# EAGLE design rs422_protect (EAGLE 7.7.0)
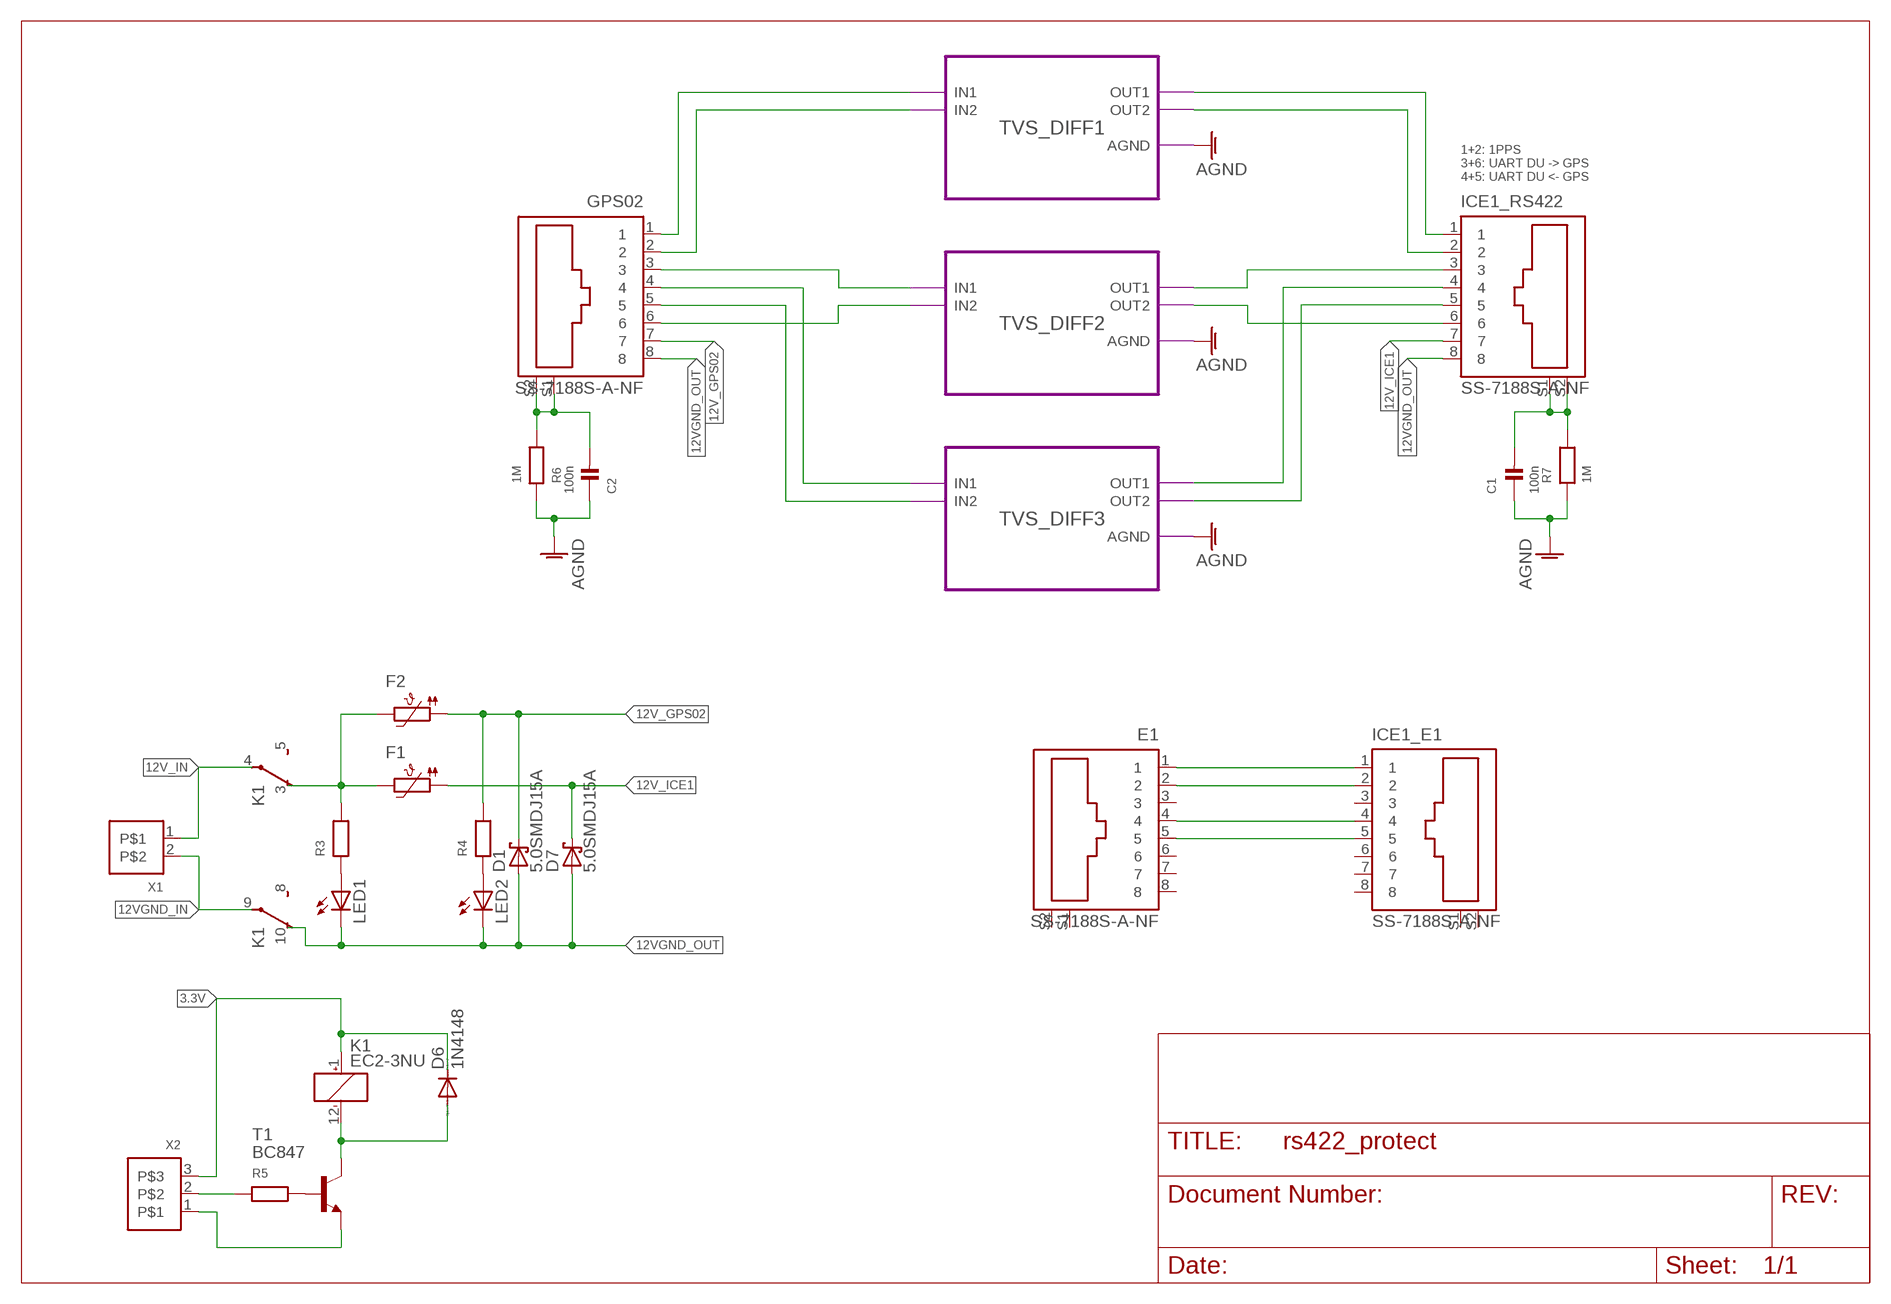
[diagram p0: schematic, sheet 1]

## Parts
C1  100n  CAP_CERAMIC_0603  [_0603]
C2  100n  CAP_CERAMIC_0603  [_0603]
D1  5.0SMDJ15A  SCHOTTKY-DIODESMC  [SMC]
D6  1N4148  DIODE-SOD323-W  [SOD323-W]
D7  5.0SMDJ15A  SCHOTTKY-DIODESMC  [SMC]
E1  SS-7188S-A-NF  [SS-7188S-A-NF]
F1  POLYFUSE-1812  [1812]
F2  POLYFUSE-1812  [1812]
GPS02  SS-7188S-A-NF  [SS-7188S-A-NF]
ICE1_E1  SS-7188S-A-NF  [SS-7188S-A-NF]
ICE1_RS422  SS-7188S-A-NF  [SS-7188S-A-NF]
K1  EC2-3NU  EC2-_S  [EC2-SINGLECOIL]
LED1  LEDCHIPLED_0805  [CHIPLED_0805]
LED2  LEDCHIPLED_0805  [CHIPLED_0805]
R3  RESISTOR_0603  [_0603]
R4  RESISTOR_0603  [_0603]
R5  RESISTOR_0603  [_0603]
R6  1M  RESISTOR_0603  [_0603]
R7  1M  RESISTOR_0603  [_0603]
T1  BC847  [SOT23]
X1  RIA_1X2-230  [RIA230]
X2  RIA_1X3-182  [RIA182-03]

## Module instances
TVS_DIFF1 = TVS_DIFF
TVS_DIFF2 = TVS_DIFF
TVS_DIFF3 = TVS_DIFF

## Nets
3.3V: D6.C K1.1(+) X2.3
12V_GPS02: D1.C F2.1 GPS02.7 R4.2
12V_ICE1: D7.C F1.1 ICE1_RS422.7
12V_IN: K1.4(P) X1.1
12V_SWITCHED: F1.2 F2.2 K1.3(O) R3.2
12VGND_IN: K1.9(P) X1.2
12VGND_OUT: D1.A D7.A GPS02.8 ICE1_RS422.8 K1.10(O) LED1.C LED2.C
AGND: C1.1 C2.1 R6.1 R7.1 ; port TVS_DIFF3.AGND TVS_DIFF2.AGND TVS_DIFF1.AGND
N$1: GPS02.1 ; port TVS_DIFF1.IN1
N$2: GPS02.2 ; port TVS_DIFF1.IN2
N$3: D6.A K1.12(-) T1.3(C)
N$4: C2.2 GPS02.S1 GPS02.S2 R6.2
N$5: R5.2 T1.1(B)
N$6: C1.2 ICE1_RS422.S1 ICE1_RS422.S2 R7.2
N$7: LED1.A R3.1
N$8: LED2.A R4.1
N$9: R5.1 X2.2
N$10: GPS02.3 ; port TVS_DIFF2.IN1
N$11: GPS02.6 ; port TVS_DIFF2.IN2
N$12: T1.2(E) X2.1
N$13: GPS02.4 ; port TVS_DIFF3.IN1
N$14: GPS02.5 ; port TVS_DIFF3.IN2
N$15: ICE1_RS422.1 ; port TVS_DIFF1.OUT1
N$16: ICE1_RS422.2 ; port TVS_DIFF1.OUT2
N$17: ICE1_RS422.3 ; port TVS_DIFF2.OUT1
N$18: ICE1_RS422.6 ; port TVS_DIFF2.OUT2
N$19: ICE1_RS422.4 ; port TVS_DIFF3.OUT1
N$20: ICE1_RS422.5 ; port TVS_DIFF3.OUT2
N$21: E1.1 ICE1_E1.1
N$22: E1.2 ICE1_E1.2
N$23: E1.4 ICE1_E1.4
N$24: E1.5 ICE1_E1.5
Unconnected: E1.3 E1.6 E1.7 E1.8 E1.S1 E1.S2 ICE1_E1.3 ICE1_E1.6 ICE1_E1.7 ICE1_E1.8 ICE1_E1.S1 ICE1_E1.S2 K1.5(S) K1.8(S)

## Notes on the sheet
- 1+2: 1PPS
  3+6: UART DU -> GPS
  4+5: UART DU <- GPS

## Library data of the parts
C1 C2 = rc-sysmocom:CAP_CERAMIC: Ceramic Capacitors 0402 - 0402 Surface Mount Capacitors 16pF 50V 5% [Digikey: 445-4899-2-ND] 18pF 50V 5% [Digikey: 490-1281-2-ND] 22pF 50V 5% [Digikey: 490-1283-2-ND] 68pF 50V 5% [Digikey: 490-1289-2-ND] 0.1uF 10V 10% [Digikey: 490-1318-2-ND] 1.0uF 6.3V 10% [Digikey: 490-1320-2-ND] 0603 - 0603 Surface Mount Capacitors 16 pF 50V 5% [Digikey: 445-5051-2-ND] 22 pF 50V [Digikey: PCC220ACVTR-ND] 33 pF 50V 5% [Digikey: 490-1415-1-ND] 56pF 50V 5% [Digikey: 490-1421-1-ND] 220pF 50V 5% [Digikey: 445-1285-1-ND] 680 pF 50V 2200 pF 50V 5% C0G [Digikey: 445-1297-1-ND] 5600 pF 100V 5% X7R [Digikey: 478-3711-1-ND] 0.1 µF 25V 10% [Digikey: PCC2277TR-ND] 0.22 µF 16V 10% X7R [Digikey: 445-1318-1-ND] 1.0 µF 25V 10% [Digikey: 445-5146-2-ND] 0603 - RF Specific 3pF 250V +/-0.1pF RF [Digikey: 712-1347-1-ND] 18 pF 250V 5% [Digikey: 478-3505-1-ND or 712-1322-1-ND] 56 pF 250V 5% C0G RF [Digikey: 490-4867-1-ND] 68 pF 250V RF [Digikey: 490-4868-1-ND] 0805 - 0805 Surface Mount Capacitors 220 pF 250V 2% RF Ceramic Capacitor [Digikey: 712-1398-1-ND] 1000 pF 50V 2% NP0 Ceramic Capacitor [Digikey: 478-3760-1-ND] 0.1 µF 25V 10% Ceramic Capacitor [Digikey: PCC1828TR-ND] 1.0 µF 16V 10% Ceramic Capacitor[Digikey: 490-1691-2-ND] 10.0 µF 10V 10% Ceramic Capacitor[Digikey: 709-1228-1-ND] 10.0 uF 16V 10% Ceramic Capacitor [Digikey: 478-5165-2-ND] 47 uF 6.3V 20% Ceramic Capacitor [Digikey: 587-1779-1-ND or 399-5506-1-ND] 1206 - 1206 Surface Mount Capacitors 47uF 10V 20% Ceramic Capacitor [Digikey: 490-5528-1-ND or 399-5508-1-ND or 445-6010-1-ND] 100uF 6.3V -20%, +80% Y5V Ceramic Capacitor (Digikey: 490-4512-1-ND, Mouser: 81-GRM31CF50J107ZE1L) 1810 - 1810 Surface Mount Capacitors High volt MLC; no solder stop between for higher isolation
D1 D7 = diode:SCHOTTKY-DIODE: Schottky Diode
D6 = diode:DIODE-: DIODE
E1 GPS02 ICE1_E1 ICE1_RS422 = stewart-rj45:SS-7188S-A-NF: Bel Stewart SS-7188S-A-NF RJ45 connector; MANUFACTURER: Bel Stewart; OC_DIGIKEY: 380-1047-ND
F1 F2 = littlefuse:POLYFUSE
K1 = relay-sysmo:EC2-_S: Miniature Signal Relays, KEMET EC2 Series single coil latch type
LED1 LED2 = led:LED: LED OSRAM: - CHIPLED LG R971, LG N971, LY N971, LG Q971, LY Q971, LO R971, LY R971 LH N974, LH R974 LS Q976, LO Q976, LY Q976 LO Q996 - Hyper CHIPLED LW Q18S LB Q993, LB Q99A, LB R99A - SideLED LS A670, LO A670, LY A670, LG A670, LP A670 LB A673, LV A673, LT A673, LW A673 LH A674 LY A675 LS A676, LA A676, LO A676, LY A676, LW A676 LS A679, LY A679, LG A679 - Hyper Micro SIDELED® LS Y876, LA Y876, LO Y876, LY Y876 LT Y87S - SmartLED LW L88C, LW L88S LB L89C, LB L89S, LG L890 LS L89K, LO L89K, LY L89K LS L896, LA L896, LO L896, LY L896 - TOPLED LS T670, LO T670, LY T670, LG T670, LP T670 LSG T670, LSP T670, LSY T670, LOP T670, LYG T670 LG T671, LOG T671, LSG T671 LB T673, LV T673, LT T673, LW T673 LH T674 LS T676, LA T676, LO T676, LY T676, LB T676, LH T676, LSB T676, LW T676 LB T67C, LV T67C, LT T67C, LS T67K, LO T67K, LY T67K, LW E67C LS E67B, LA E67B, LO E67B, LY E67B, LB E67C, LV E67C, LT E67C LW T67C LS T679, LY T679, LG T679 LS T770, LO T770, LY T770, LG T770, LP T770 LB T773, LV T773, LT T773, LW T773 LH T774 LS E675, LA E675, LY E675, LS T675 LS T776, LA T776, LO T776, LY T776, LB T776 LHGB T686 LT T68C, LB T68C - Hyper Mini TOPLED® LB M676 - Mini TOPLED Santana® LG M470 LS M47K, LO M47K, LY M47K Source: http://www.osram.convergy.de LUXEON: - LUMILED® LXK2-PW12-R00, LXK2-PW12-S00, LXK2-PW14-U00, LXK2-PW14-V00 LXK2-PM12-R00, LXK2-PM12-S00, LXK2-PM14-U00 LXK2-PE12-Q00, LXK2-PE12-R00, LXK2-PE12-S00, LXK2-PE14-T00, LXK2-PE14-U00 LXK2-PB12-K00, LXK2-PB12-L00, LXK2-PB12-M00, LXK2-PB14-N00, LXK2-PB14-P00, LXK2-PB14-Q00 LXK2-PR12-L00, LXK2-PR12-M00, LXK2-PR14-Q00, LXK2-PR14-R00 LXK2-PD12-Q00, LXK2-PD12-R00, LXK2-PD12-S00 LXK2-PH12-R00, LXK2-PH12-S00 LXK2-PL12-P00, LXK2-PL12-Q00, LXK2-PL12-R00 Source: www.luxeon.com KINGBRIGHT: KA-3528ASYC Source: www.kingbright.com
R3-R7 = rc-sysmocom:RESISTOR: Resistors 0402 - 0402 Surface Mount Package 22 Ohm 1% 1/16W [Digikey: 311-22.0LRTR-ND] 33 Ohm 5% 1/16W 1.0K 5% 1/16W 1.5K 5% 1/16W 2.0K 1% 1/16W 10.0K 1% 1/16W [Digikey: 311-10.0KLRTR-ND] 10.0K 5% 1/16W [Digikey: RMCF0402JT10K0TR-ND] 12.1K 1% 1/16W [Digikey: 311-22.0LRTR-ND] 100.0K 5% 1/16W 0603 - 0603 Surface Mount Package 1/10 Watt 0805 - 0805 Surface Mount Package 1/8 Watt 1206 - 1206 Surface Mount Package 2012 - 2010 Surface Mount Package 0.11 Ohm 1/2 Watt 1% Resistor - Digikey: RHM.11UCT-ND
T1 = transistor:BC847: NPN TRANSISTOR
X1 = RIA-PlugCon:RIA_1X2
X2 = RIA-PlugCon:RIA_1X3

## Module TVS_DIFF
Ports: IN1(io) IN2(io) OUT1(io) OUT2(io) AGND(io)
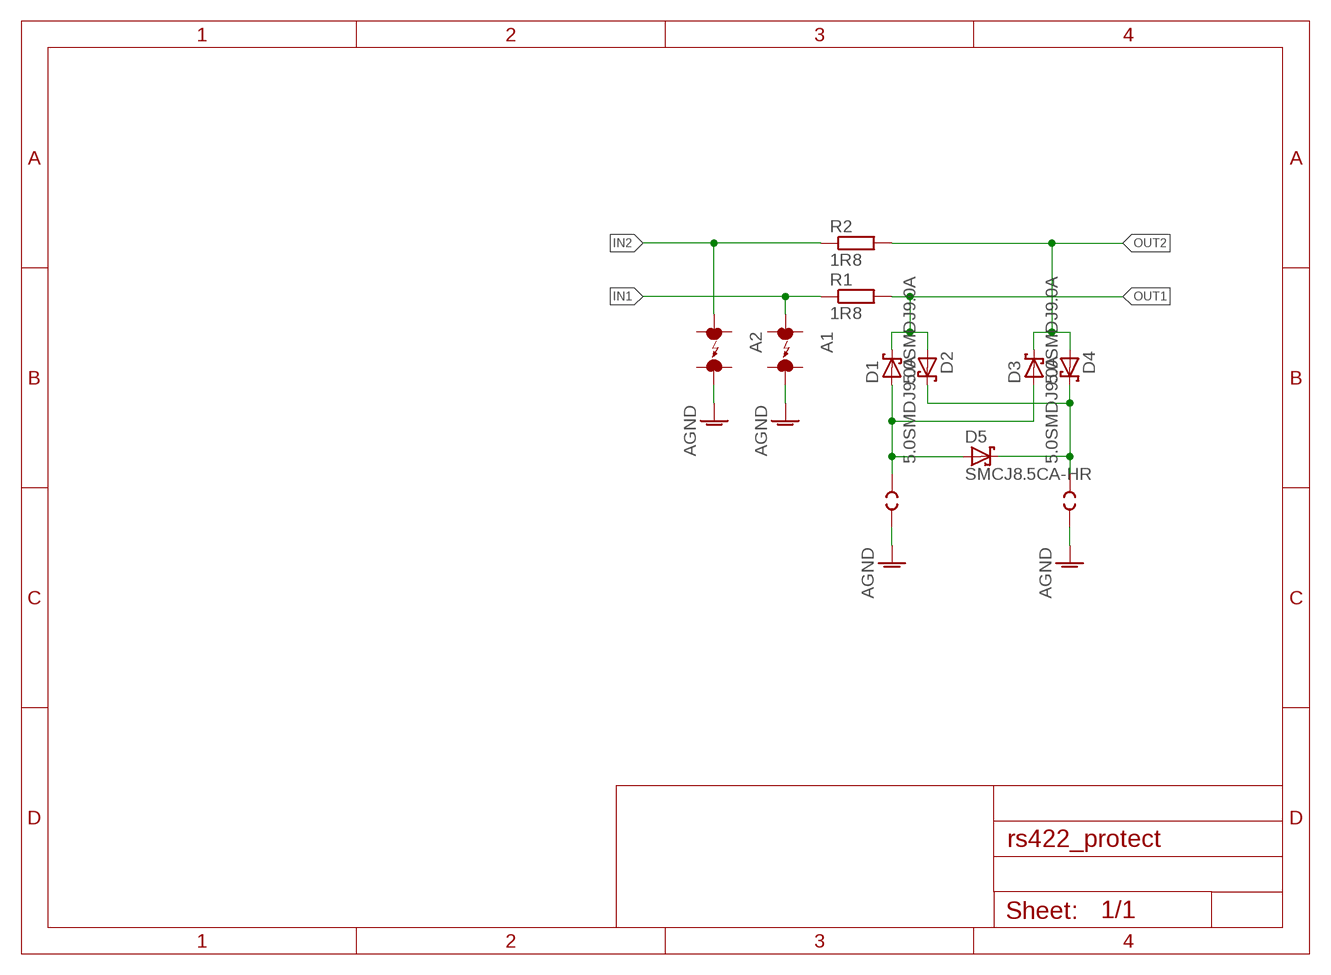
[diagram p1: schematic, module TVS_DIFF, sheet 1]

### Parts
A1  EPCOS_ARRESTER  [EPCOS_SURGE_ARRESTOR]
A2  EPCOS_ARRESTER  [EPCOS_SURGE_ARRESTOR]
D1  5.0SMDJ9.0A  SCHOTTKY-DIODESMC  [SMC]
D2  5.0SMDJ9.0A  SCHOTTKY-DIODESMC  [SMC]
D3  5.0SMDJ9.0A  SCHOTTKY-DIODESMC  [SMC]
D4  5.0SMDJ9.0A  SCHOTTKY-DIODESMC  [SMC]
D5  SMCJ8.5CA-HR  SCHOTTKY-DIODESMC  [SMC]
R1  1R8  R-EU_MELF0207W  [MINI_MELF-0207W]
R2  1R8  R-EU_MELF0207W  [MINI_MELF-0207W]
U$1  ARCGAP-2MM  [ARC_GAP]
U$2  ARCGAP-2MM  [ARC_GAP]

### Nets
AGND: A1.2 A2.2 U$1.P$1 U$2.P$1
IN1: A1.1 R1.1
IN2: A2.1 R2.1
N$1: D1.A D3.A D5.A U$1.P$2
N$2: D2.C D4.C D5.C U$2.P$2
OUT1: D1.C D2.A R1.2
OUT2: D3.C D4.A R2.2

### Library data of the parts
A1 A2 = laforge:EPCOS_ARRESTER
D1-D5 = diode:SCHOTTKY-DIODE: Schottky Diode
R1 R2 = rcl:R-EU_: RESISTOR, European symbol
U$1 U$2 = laforge:ARCGAP

## Board
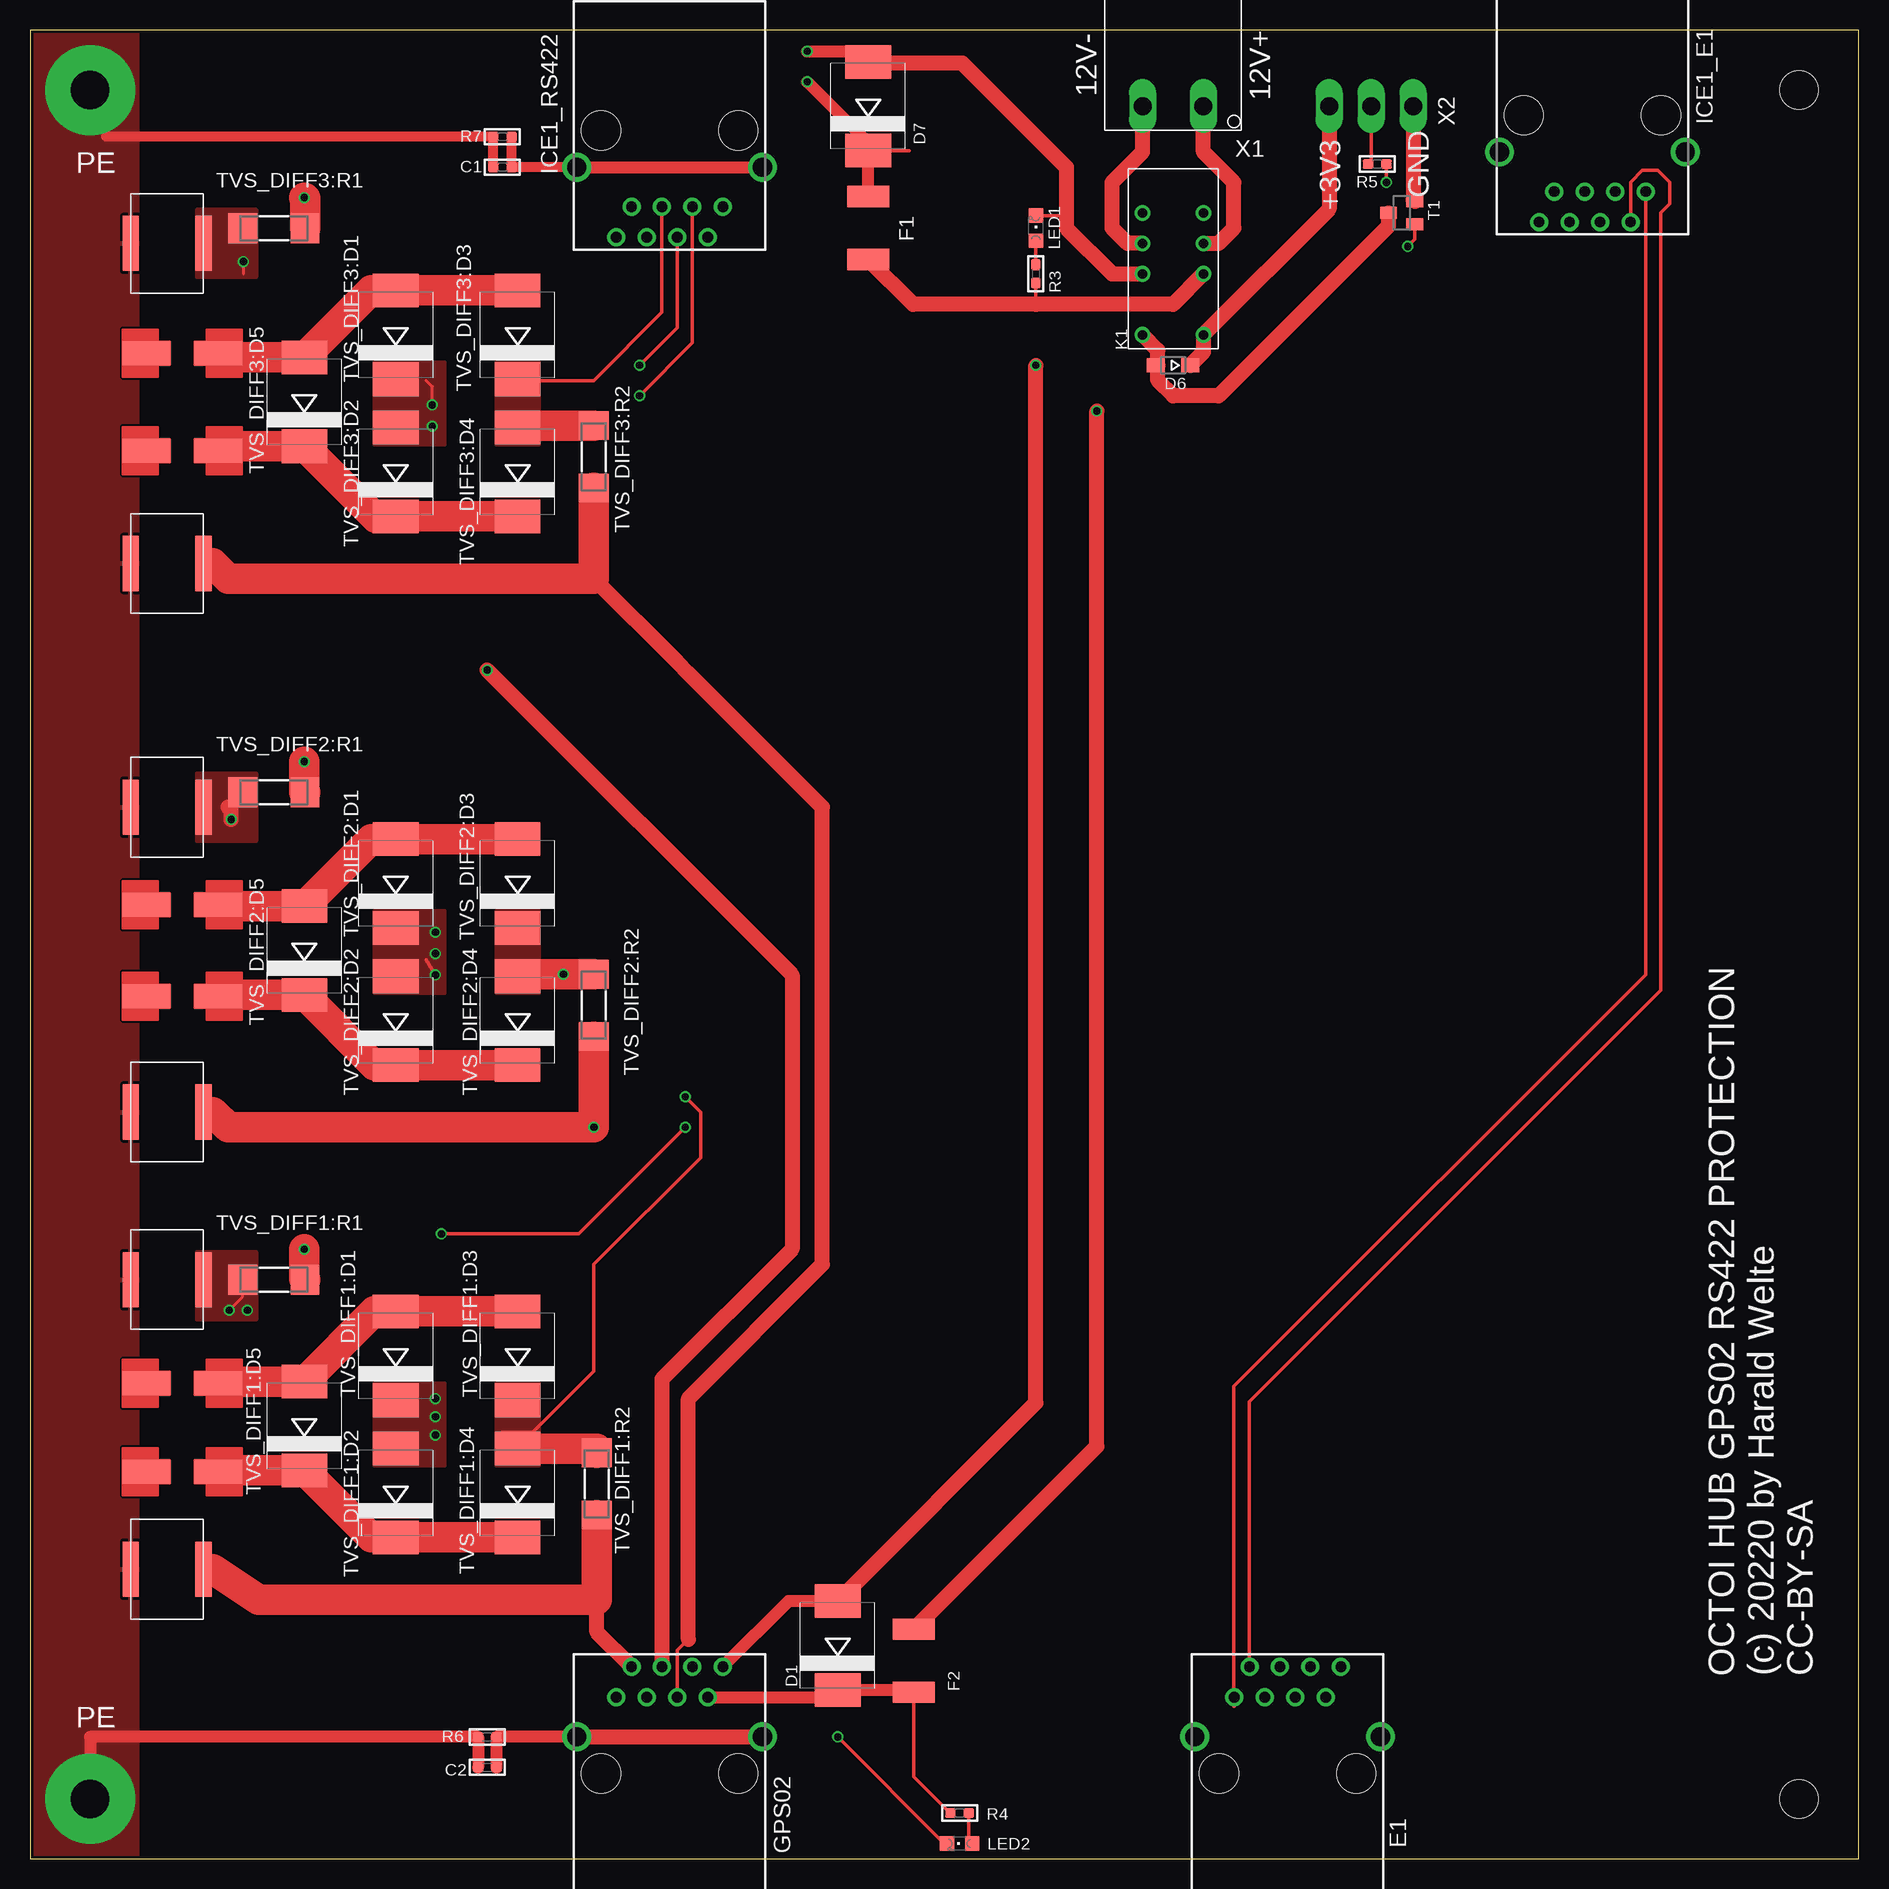
[diagram p2: board, top side]
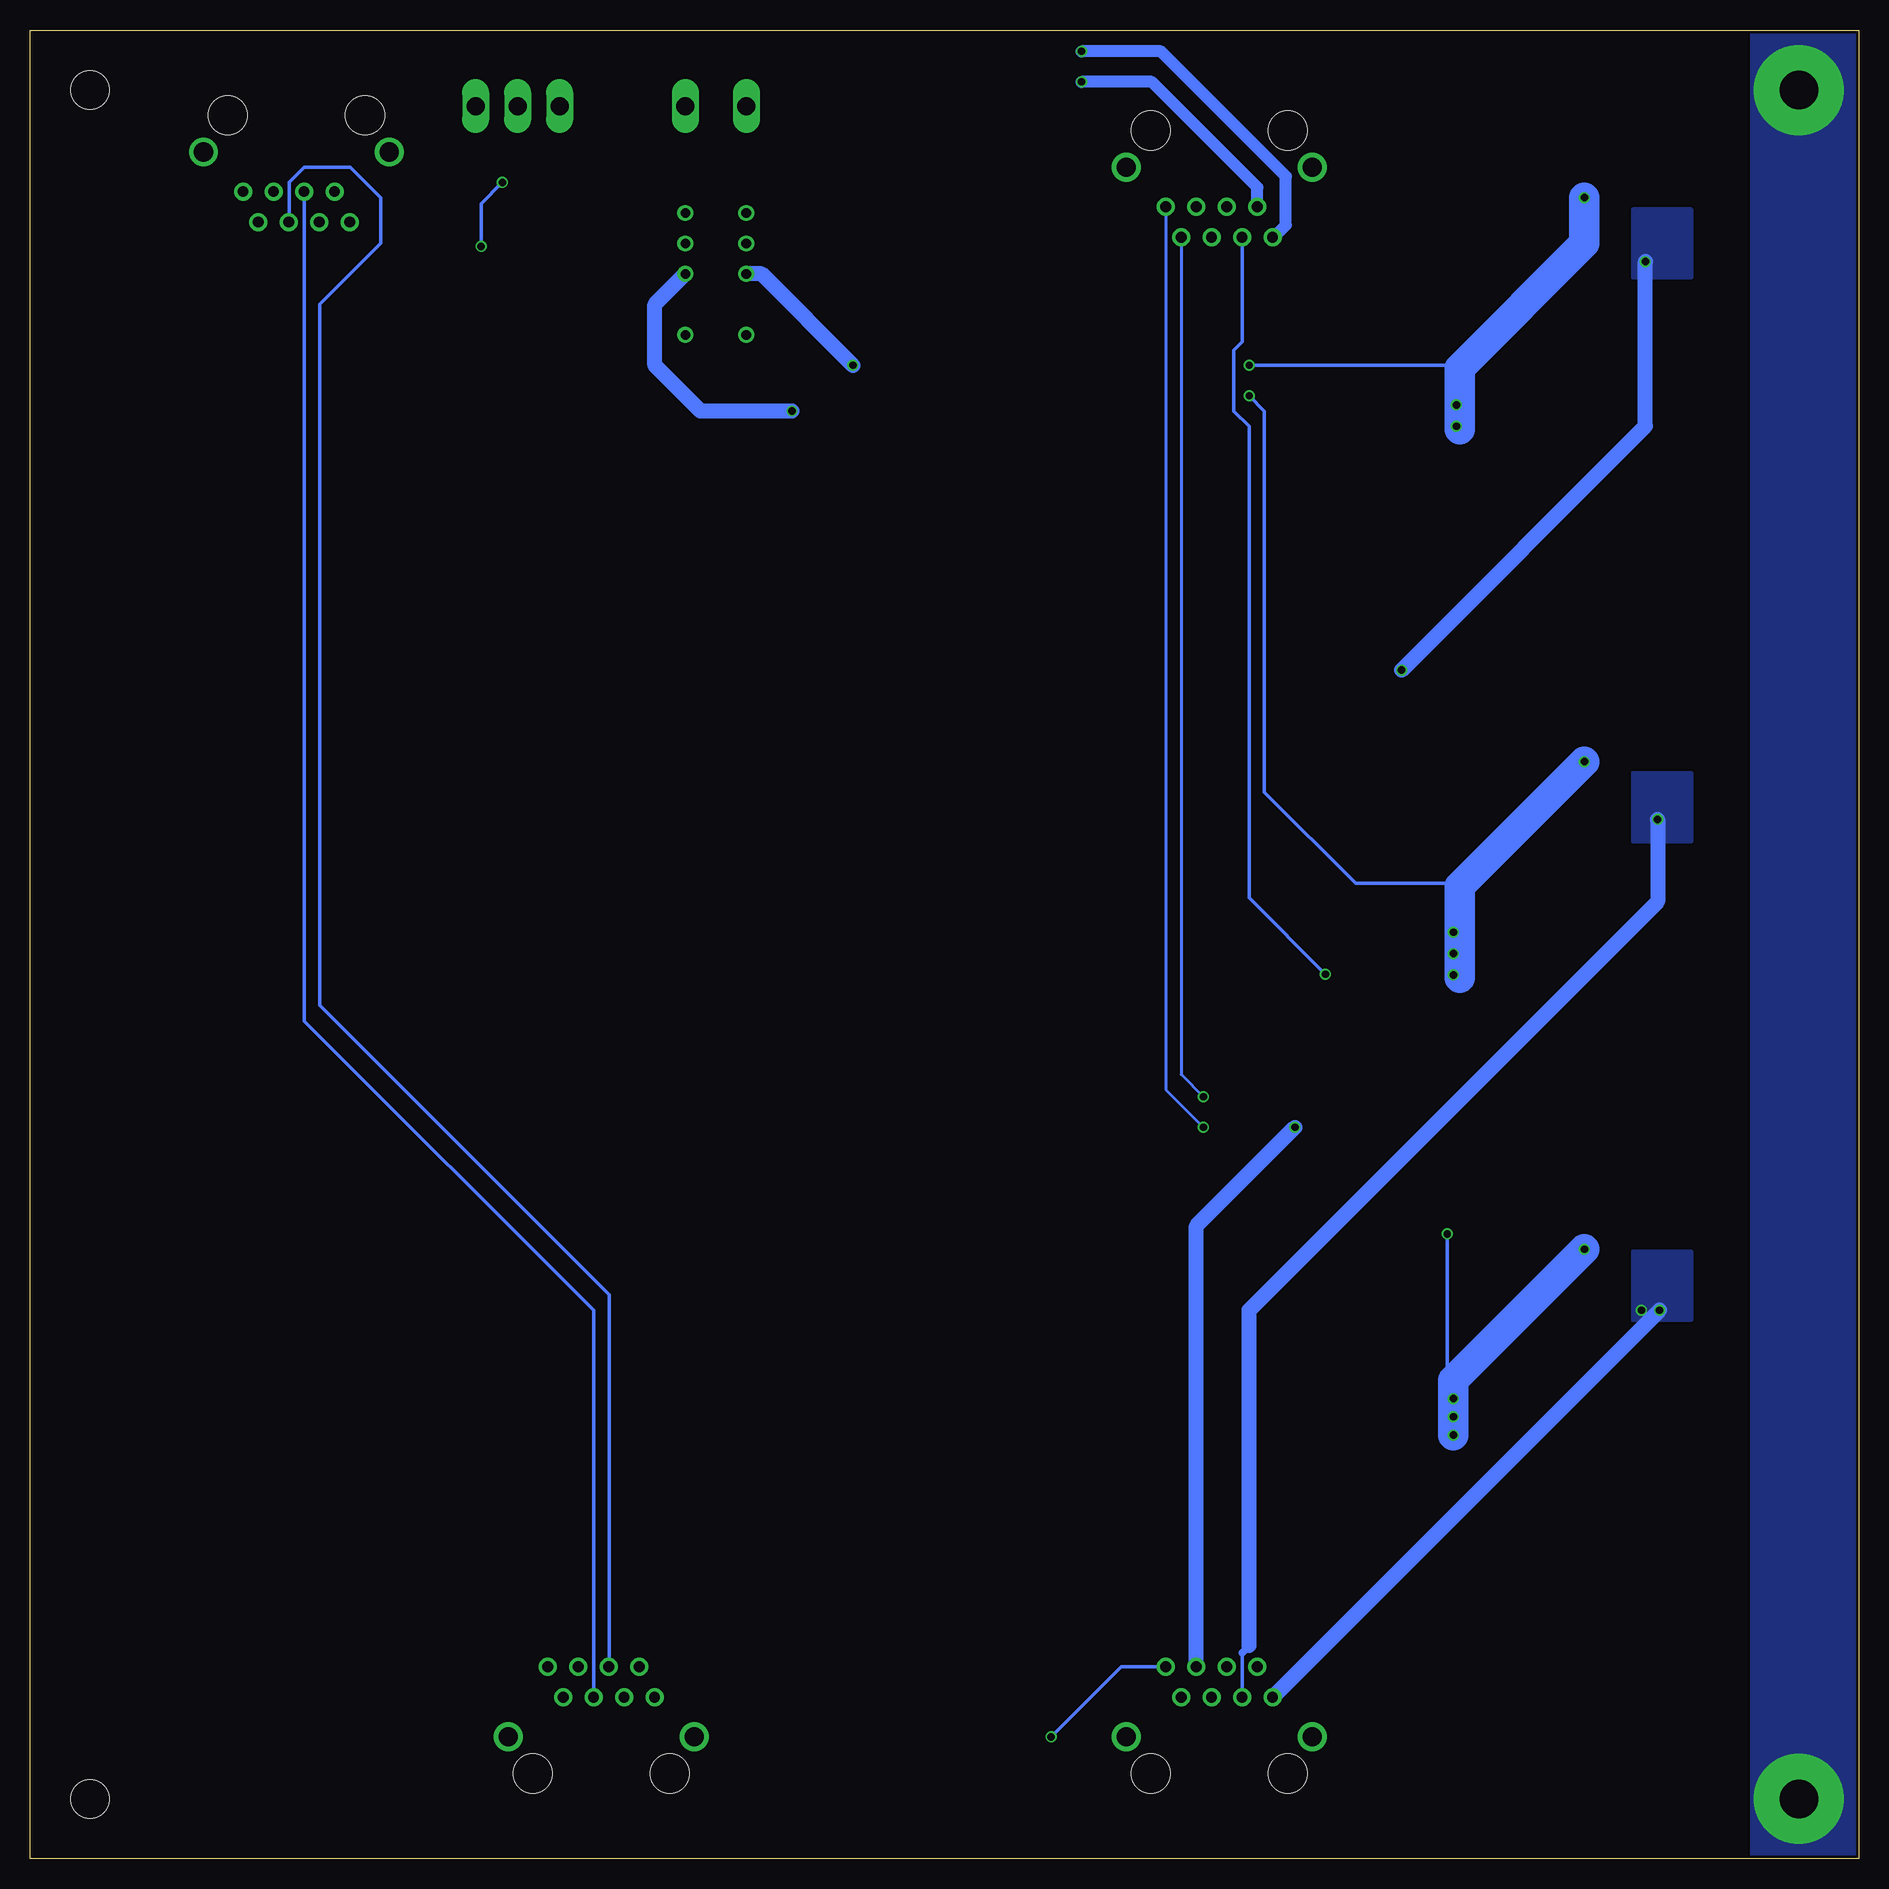
[diagram p3: board, bottom side, seen from below]

Size 152.4 x 152.4 mm. Coordinates in mm from the lower left corner, seen from the top.
Outline: 0,0 152.4,0 152.4,152.4 0,152.4 0,0
Copper layers (1*16): Top 0.035mm / dielectric 1.5mm / Bottom 0.035mm
Design rules "SeeedStudio_2layer_DRU_no_angle_20140221": minimum track width 6mil, minimum drill 12mil, track to track 6mil, track to pad 6mil, pad to pad 6mil, via to via 6mil, smd to smd 0mil, copper to edge 10mil, drill to drill 10mil, minimum pad ring 10mil, minimum via ring 6mil, stop-mask expansion 2mil, vias tented up to drill 100mil, thermal gap 10mil
Holes 3.2 mm at 147.4,147.4 147.4,5

### Footprints (pad centres in the part's own frame; a part is rotated, then mirrored left to right if it is on the bottom)
_0603 = smd 0.9 x 0.8: 1 -0.762,0; 2 0.762,0
SMC = smd 2.8 x 3.8: A 3.7,0; C -3.7,0
SOD323-W = smd 1.5 x 1.2: A 1.45,0; C -1.45,0
SS-7188S-A-NF = drill 0.9 pad 1.5: 1 -4.445,4.572; 2 -3.175,7.112; 3 -1.905,4.572; 4 -0.635,7.112; 5 0.635,4.572; 6 1.905,7.112; 7 3.175,4.572; 8 4.445,7.112 | drill 1.6 pad 2.2: S1 -7.747,1.27; S2 7.747,1.27 | hole 3.251: -5.715,-1.778; 5.715,-1.778
1812 = smd 1.78 x 3.5: 1 -2.625,0; 2 2.615,0
EC2-SINGLECOIL = drill 0.8: 1 -6.35,-2.54; 3 -1.27,-2.54; 4 1.27,-2.54; 5 3.81,-2.54; 8 3.81,2.54; 9 1.27,2.54; 10 -1.27,2.54; 12 -6.35,2.54
CHIPLED_0805 = smd 1.2 x 1.2: A 0,-1.05; C 0,1.05
SOT23 = smd 1 x 1.4: 1 -0.95,-1.1; 2 0.95,-1.1; 3 0,1.1
EPCOS_SURGE_ARRESTOR = smd 1.35 x 4.6: 1 -3.025,0; 2 3.025,0
MINI_MELF-0207W = smd 2.4 x 2.5: 1 -2.6,0; 2 2.6,0
ARC_GAP = smd 4 x 2: P$1 -3,0; P$2 3,0
RIA230 = drill 1.5 long: 1 -2.54,0; 2 2.54,0
RIA182-03 = drill 1.5 long: 1 -3.5,0; 2 0,0; 3 3.5,0

### Placement (x,y rotation side)
C1  39.37,140.97 0 top
C2  38.1,7.62 0 top
D1  67.31,17.78 90 top
D6  95.25,124.46 180 top
D7  69.85,146.05 90 top
E1  104.8,8.89 0 top
F1  69.85,135.89 270 top
F2  73.66,16.51 90 top
GPS02  53.3,8.89 0 top
ICE1_E1  130.2,143.51 180 top
ICE1_RS422  53.3,142.24 180 top
K1  95.25,133.35 90 top
LED1  83.82,135.89 0 top
LED2  77.47,1.27 90 top
R3  83.82,132.08 270 top
R4  77.47,3.81 180 top
R5  112.27,141.22 0 top
R6  38.1,10.16 0 top
R7  39.37,143.51 0 top
T1  114.3,137.16 90 top
TVS_DIFF1:A1  [EPCOS_SURGE_ARRESTOR]  11.43,48.26 180 top
TVS_DIFF1:A2  [EPCOS_SURGE_ARRESTOR]  11.43,24.13 180 top
TVS_DIFF1:D1  5.0SMDJ9.0A  [SMC]  30.48,41.91 90 top
TVS_DIFF1:D2  5.0SMDJ9.0A  [SMC]  30.48,30.48 90 top
TVS_DIFF1:D3  5.0SMDJ9.0A  [SMC]  40.64,41.91 90 top
TVS_DIFF1:D4  5.0SMDJ9.0A  [SMC]  40.64,30.48 90 top
TVS_DIFF1:D5  SMCJ8.5CA-HR  [SMC]  22.86,36.07 90 top
TVS_DIFF1:R1  1R8  [MINI_MELF-0207W]  20.32,48.26 0 top
TVS_DIFF1:R2  1R8  [MINI_MELF-0207W]  47.24,31.24 90 top
TVS_DIFF1:U$1  ARCGAP-2MM  [ARC_GAP]  12.7,39.62 0 top
TVS_DIFF1:U$2  ARCGAP-2MM  [ARC_GAP]  12.7,32.26 0 top
TVS_DIFF2:A1  [EPCOS_SURGE_ARRESTOR]  11.43,87.63 180 top
TVS_DIFF2:A2  [EPCOS_SURGE_ARRESTOR]  11.43,62.23 180 top
TVS_DIFF2:D1  5.0SMDJ9.0A  [SMC]  30.48,81.28 90 top
TVS_DIFF2:D2  5.0SMDJ9.0A  [SMC]  30.48,69.85 90 top
TVS_DIFF2:D3  5.0SMDJ9.0A  [SMC]  40.64,81.28 90 top
TVS_DIFF2:D4  5.0SMDJ9.0A  [SMC]  40.64,69.85 90 top
TVS_DIFF2:D5  SMCJ8.5CA-HR  [SMC]  22.86,75.69 90 top
TVS_DIFF2:R1  1R8  [MINI_MELF-0207W]  20.32,88.9 0 top
TVS_DIFF2:R2  1R8  [MINI_MELF-0207W]  46.99,71.12 90 top
TVS_DIFF2:U$1  ARCGAP-2MM  [ARC_GAP]  12.7,79.5 0 top
TVS_DIFF2:U$2  ARCGAP-2MM  [ARC_GAP]  12.7,71.88 0 top
TVS_DIFF3:A1  [EPCOS_SURGE_ARRESTOR]  11.43,134.62 180 top
TVS_DIFF3:A2  [EPCOS_SURGE_ARRESTOR]  11.43,107.95 180 top
TVS_DIFF3:D1  5.0SMDJ9.0A  [SMC]  30.48,127 90 top
TVS_DIFF3:D2  5.0SMDJ9.0A  [SMC]  30.48,115.57 90 top
TVS_DIFF3:D3  5.0SMDJ9.0A  [SMC]  40.64,127 90 top
TVS_DIFF3:D4  5.0SMDJ9.0A  [SMC]  40.64,115.57 90 top
TVS_DIFF3:D5  SMCJ8.5CA-HR  [SMC]  22.86,121.41 90 top
TVS_DIFF3:R1  1R8  [MINI_MELF-0207W]  20.32,135.89 0 top
TVS_DIFF3:R2  1R8  [MINI_MELF-0207W]  46.99,116.84 90 top
TVS_DIFF3:U$1  ARCGAP-2MM  [ARC_GAP]  12.7,125.48 0 top
TVS_DIFF3:U$2  ARCGAP-2MM  [ARC_GAP]  12.7,117.35 0 top
X1  95.25,146.05 180 top
X2  111.76,146.05 180 top

### Tracks (layer width: path | path; a pad name or v marks a point on that pad's centre or on a via)
3.3V
  Top 1.27: X2.3 108.26,137.47 K1.1 97.79,125.55 D6.C
12V_GPS02
  Top 0.305: F2.1 73.66,6.86 R4.2
  Top 1.016: GPS02.7 66.69,13.46 D1.C 72.19,14.08 F2.1
12V_ICE1  (via drill 0.61)
  Top 0.305: 73.26,142.35 D7.C
  Top 1.016: v64.77,148.08 69.85,143 D7.C F1.1
  Bottom 1.016: ICE1_RS422.7 50.12,139.28 58.93,148.08 v64.77,148.08
12V_IN
  Top 1.27: K1.4 99.06,134.62 100.33,135.89 100.33,139.7 97.79,142.24 X1.1
12V_SWITCHED  (via drill 0.61)
  Top 0.305: R3.2 83.82,129.54
  Top 1.27: K1.3 95.25,129.54 83.82,129.54 73.58,129.54 F1.2 | F2.2 88.9,34.37 v88.9,120.65
  Bottom 1.27: v88.9,120.65 96.52,120.65 100.33,124.46 100.33,129.54 K1.3
12VGND_IN
  Top 1.27: K1.9 91.44,134.62 90.17,135.89 90.17,139.7 92.71,142.24 X1.2
12VGND_OUT  (via drill 0.61)
  Top 0.305: LED1.C 86.14,136.94 86.36,137.16 | LED2.C 76.2,1.27 v67.31,10.16
  Top 1.016: v64.77,150.62 68.98,150.62 D7.A | D1.A 63.22,21.48 GPS02.8
  Top 1.27: K1.10 90.17,132.08 86.36,135.89 86.36,137.16 86.36,140.97 77.69,149.64 69.96,149.64 D7.A | D1.A 83.82,37.99 v83.82,124.46
  Bottom 0.305: v67.31,10.16 61.47,16 GPS02.8
  Bottom 1.016: ICE1_RS422.8 48.77,135.13 47.75,136.14 47.75,140.21 58.17,150.62 v64.77,150.62
  Bottom 1.27: v83.82,124.46 91.44,132.08 K1.10
AGND  (via drill 3.2 pad 7.5)
  Top 0.813: 6.35,143.51 R7.1 C1.1
  Top 1.016: C2.1 R6.1 5,10.16 v5,5
  other vias: 5,147.4
  pour Bottom: 0,152.4 8.89,152.4 8.89,0 0,0
  pour Top: 0,152.4 8.89,152.4 8.89,0 0,0
N$1  (via drill 0.61)
  Top 0.254: v16.6,45.72 17.72,46.84 TVS_DIFF1:R1.1
  Bottom 1.016: v16.6,45.72 16.51,45.72
  Bottom 1.27: GPS02.1 v16.6,45.72
  other vias: 18.12,45.72
  pour Top (no thermals): 13.97,50.55 18.8,50.55 18.8,44.96 13.97,44.96
  pour Bottom (no thermals): 13.97,50.55 18.8,50.55 18.8,44.96 13.97,44.96
N$2
  Top 1.27: 15.24,24.13 TVS_DIFF1:A2.1 | GPS02.2 47.24,18.88 47.24,24.13
  Top 2.54: TVS_DIFF1:R2.1 47.24,24.13 47.24,21.59 19.05,21.59 15.24,24.13
N$3
  Top 0.254: D6.A 93.98,124.46
  Top 1.27: T1.3 113.2,136.06 99.06,121.92 95.25,121.92 93.98,123.19 93.98,124.46 93.98,125.73 K1.12
N$4
  Top 1.016: GPS02.S1 R6.2 C2.2
  Top 1.27: GPS02.S1 GPS02.S2
N$5  (via drill 0.61)
  Top 0.305: T1.1 115.4,134.96 v114.81,134.37 | v113.03,139.7 R5.2
  Bottom 0.305: v114.81,134.37 114.81,137.92 v113.03,139.7
N$6
  Top 0.813: ICE1_RS422.S2 C1.2 R7.2
  Top 1.016: ICE1_RS422.S2 ICE1_RS422.S1
N$7
  Top 0.305: LED1.A R3.1
N$8
  Top 0.305: R4.1 78.23,1.56 LED2.A
N$9
  Top 0.305: X2.2 111.76,141.48 R5.1
N$10  (via drill 0.61)
  Top 1.27: v16.76,86.61 16.76,87.38 16.51,87.63
  Bottom 0.305: GPS02.3 51.4,17.18
  Bottom 0.61: 51.4,17.18 50.8,17.78
  Bottom 1.27: 50.8,18.03 50.8,19.05 | 50.8,19.05 50.8,45.72 16.76,79.76 v16.76,86.61 | 50.8,17.78 50.8,19.05
  pour Top (no thermals): 13.97,90.42 18.8,90.42 18.8,84.84 13.97,84.84
  pour Bottom (no thermals): 13.97,90.42 18.8,90.42 18.8,84.84 13.97,84.84
N$11  (via drill 0.61)
  Top 1.27: 15.24,62.23 TVS_DIFF2:A2.1
  Top 2.54: TVS_DIFF2:R2.1 46.99,64.77 v46.99,60.96 16.51,60.96 15.24,62.23
  Bottom 1.27: GPS02.6 55.2,52.74 v46.99,60.96
N$12
  Top 1.27: X2.1 115.26,138.25 T1.2
N$13  (via drill 0.61)
  Top 0.254: v17.78,133.1 17.78,132.08
  Top 1.27: v38.1,99.06 63.5,73.66 63.5,50.8 52.66,39.97 GPS02.4
  Bottom 1.27: v38.1,99.06 17.78,119.38 v17.78,133.1
  pour Top (no thermals): 13.97,137.41 18.8,137.41 18.8,131.83 13.97,131.83
  pour Bottom (no thermals): 13.97,137.41 18.8,137.41 18.8,131.83 13.97,131.83
N$14
  Top 0.305: GPS02.5 53.94,17.36 54.86,18.29
  Top 1.27: 15.24,107.95 TVS_DIFF3:A2.1 | 46.99,106.68 53.98,99.69 54.86,98.81 66.04,87.63 66.04,49.53 54.86,38.35 54.86,18.29
  Top 2.54: TVS_DIFF3:R2.1 46.99,106.68 16.51,106.68 15.24,107.95
N$15  (via drill 0.61)
  Top 0.305: v34.29,52.07 45.72,52.07 v54.61,60.96
  Top 2.54: TVS_DIFF1:R1.2 22.86,48.32 v22.86,50.8
  Bottom 0.254: ICE1_RS422.1 57.74,64.09 v54.61,60.96
  Bottom 0.305: v34.29,52.07 34.29,38.1 33.02,36.83 33.02,37.59 v33.78,38.35
  Bottom 2.54: v22.86,50.8 33.78,39.88 v33.78,38.35 v33.78,35.31
  other vias: 33.78,36.83
  pour Top (no thermals): 28.7,39.62 34.54,39.62 34.54,32.77 28.7,32.77
N$16  (via drill 0.61)
  Top 0.305: v54.61,63.5 55.88,62.23 55.88,58.42 46.99,49.53 46.99,40.64 41.91,35.56 39.37,35.56 39.37,35.45 TVS_DIFF1:D4.A
  Top 2.54: TVS_DIFF1:R2.2 47.24,34.18 TVS_DIFF1:D4.A
  Bottom 0.254: ICE1_RS422.2 56.48,65.36 v54.61,63.5
  pour Top (no thermals): 38.86,39.62 42.42,39.62 42.42,33.02 42.42,32.77 38.86,32.77
N$17  (via drill 0.61)
  Top 0.254: v33.78,73.66 33.02,74.93
  Top 0.305: ICE1_RS422.3 55.2,126.33 v50.8,121.92
  Top 2.54: TVS_DIFF2:R1.2 22.86,88.9 v22.86,91.44
  Bottom 0.254: v33.78,73.66 33.27,73.91 33.27,80.01 34.54,81.28
  Bottom 0.305: v50.8,121.92 49.53,120.65 49.53,88.9 41.91,81.28 34.54,81.28
  Bottom 2.54: v22.86,91.44 33.27,81.03 33.27,80.01 33.27,73.41
  other vias: 33.78,75.44 33.78,77.22
  pour Top (no thermals): 28.7,78.99 34.54,78.99 34.54,72.14 28.7,72.14
N$18  (via drill 0.61)
  Top 2.54: TVS_DIFF2:R2.2 v44.45,73.72 40.81,73.72 TVS_DIFF2:D4.A
  Bottom 0.305: ICE1_RS422.6 51.4,126.41 52.07,125.73 52.07,120.65 50.8,119.38 50.8,80.07 v44.45,73.72
  pour Top (no thermals): 38.86,78.99 42.42,78.99 42.42,72.39 42.42,72.14 38.86,72.14
N$19  (via drill 0.61)
  Top 0.254: v33.53,121.16 33.53,122.68 33.02,123.19
  Top 0.305: ICE1_RS422.4 53.94,127.59 v50.8,124.46
  Top 2.54: TVS_DIFF3:R1.2 22.92,138.37 v22.86,138.43
  Bottom 0.254: 33.27,121.92 33.27,121.41 v33.53,121.16
  Bottom 0.305: v50.8,124.46 34.29,124.46 33.02,123.19 33.02,122.17 33.27,121.92
  Bottom 2.54: v22.86,138.43 22.86,134.62 33.27,124.21 33.27,121.92 33.27,119.13
  other vias: 33.53,119.38
  pour Top (no thermals): 28.7,124.71 34.54,124.71 34.54,117.86 28.7,117.86
N$20
  Top 0.305: ICE1_RS422.5 52.66,128.87 46.99,123.19 40.75,123.19 TVS_DIFF3:D3.C
  Top 2.54: TVS_DIFF3:D4.A 40.81,119.44 TVS_DIFF3:R2.2
  pour Top (no thermals): 38.86,124.71 42.42,124.71 42.42,118.11 42.42,117.86 38.86,117.86
N$21
  Top 0.305: E1.1 100.36,12.72 100.33,12.7 100.33,39.37 134.65,73.69 ICE1_E1.1
N$22
  Top 0.305: E1.2 101.6,16.03 101.6,38.1 135.89,72.39 135.89,137.16 136.65,137.92 136.65,139.7 135.64,140.72 134.37,140.72 133.38,139.72 ICE1_E1.2
N$23
  Bottom 0.305: ICE1_E1.4 130.81,136.42 130.81,139.7 129.54,140.97 125.73,140.97 123.19,138.43 123.19,134.62 128.27,129.54 128.27,71.12 104.14,46.99 104.14,16.03 E1.4
N$24
  Bottom 0.305: ICE1_E1.5 129.54,138.91 129.54,69.8 105.44,45.7 E1.5
TVS_DIFF1:N$1
  Top 2.54: TVS_DIFF1:U$1.P$2 16.1,39.77 TVS_DIFF1:D5.A 28.7,45.61 TVS_DIFF1:D1.A TVS_DIFF1:D3.A
TVS_DIFF1:N$2
  Top 2.54: TVS_DIFF1:U$2.P$2 16.35,32.37 TVS_DIFF1:D5.C 28.45,26.78 TVS_DIFF1:D2.C TVS_DIFF1:D4.C
TVS_DIFF2:N$1
  Top 2.54: TVS_DIFF2:U$1.P$2 15.81,79.39 TVS_DIFF2:D5.A 28.45,84.98 TVS_DIFF2:D1.A TVS_DIFF2:D3.A
TVS_DIFF2:N$2
  Top 2.54: TVS_DIFF2:U$2.P$2 15.81,71.99 TVS_DIFF2:D5.C 28.7,66.15 TVS_DIFF2:D2.C TVS_DIFF2:D4.C
TVS_DIFF3:N$1
  Top 2.54: TVS_DIFF3:U$1.P$2 16.06,125.11 TVS_DIFF3:D5.A 28.45,130.7 TVS_DIFF3:D1.A TVS_DIFF3:D3.A
TVS_DIFF3:N$2
  Top 0.254: TVS_DIFF3:D2.C 31.75,111.87
  Top 2.54: TVS_DIFF3:U$2.P$2 16.06,117.71 TVS_DIFF3:D5.C 28.81,111.76 30.48,111.76 30.59,111.87 31.75,111.87 TVS_DIFF3:D4.C

### Text on the board
tNames: 12V- | 12V+ | GND | +3V3 | PE | OCTOI HUB GPS02 RS422 PROTECTION / (c) 20220 by Harald Welte / CC-BY-SA | PE